# Altium schematic sheet hdmi_block.SchDoc
size A4; DrawnBy: ee; SheetTotal: HDMI Socket with ESD protection and level translator
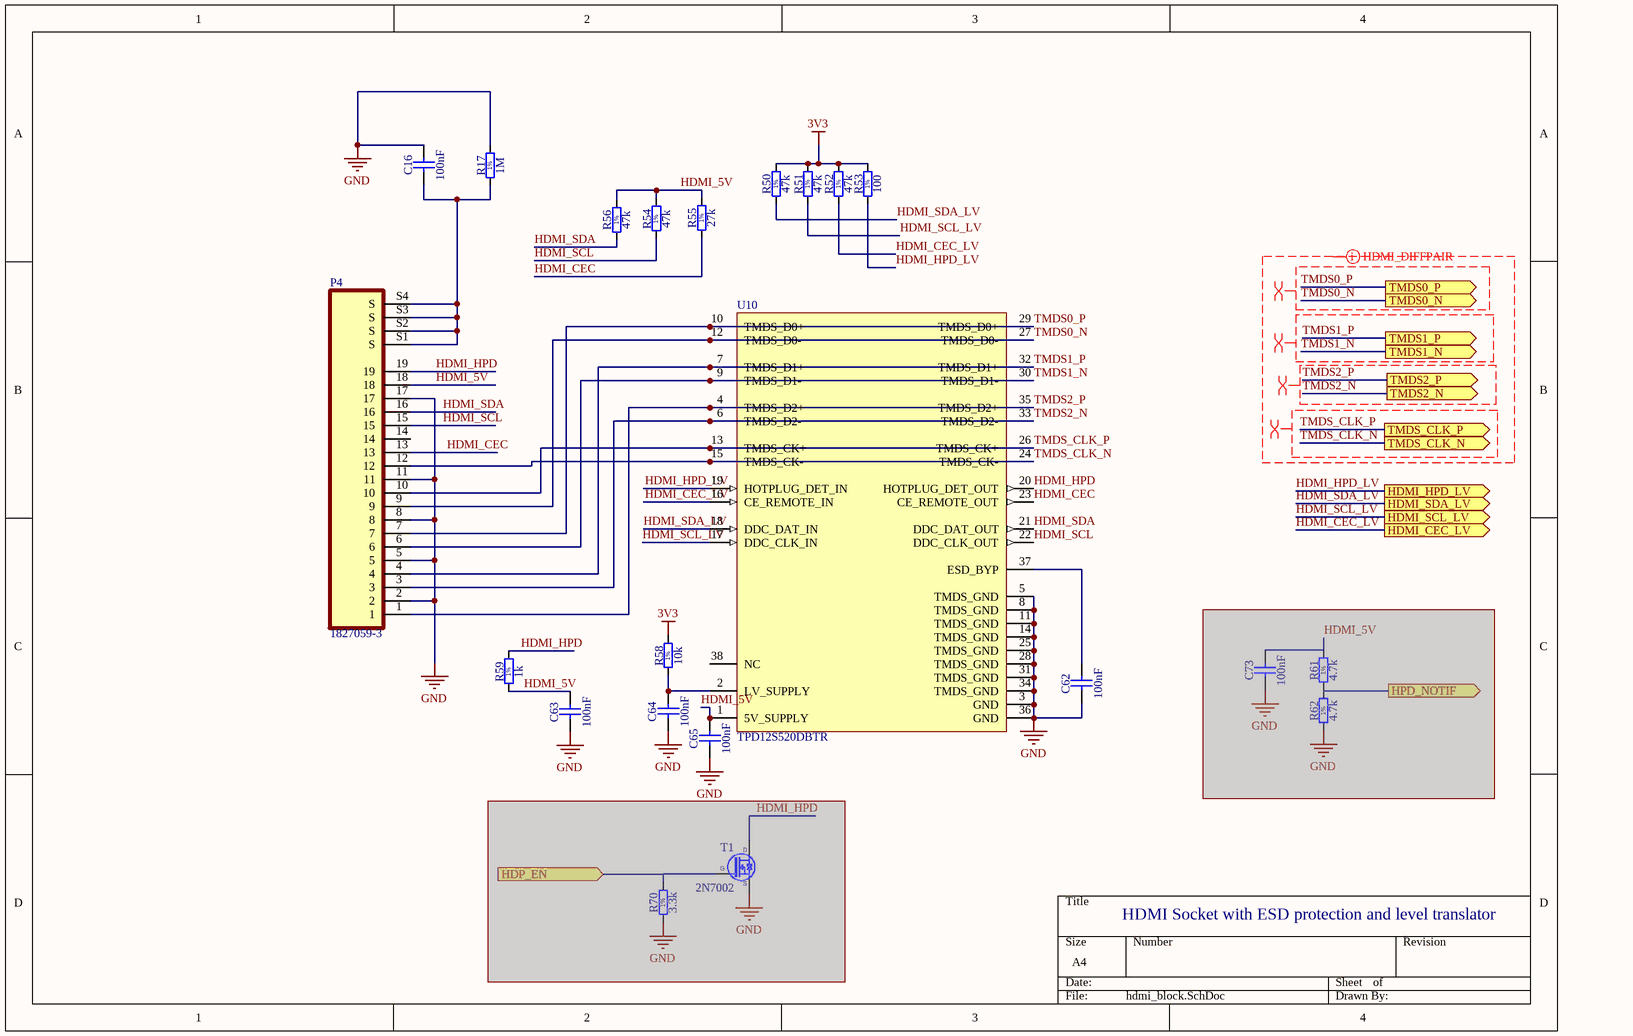
[diagram p0: hdmi_block.SchDoc]

## Parts
C16  100nF  [CAPC2013X100N]
C62  100nF  [CAPC2013X100N]
C63  100nF  [CAPC2013X100N]
C64  100nF  [CAPC2013X100N]
C65  100nF  [CAPC2013X100N]
C73  100nF  [CAPC2013X100N]  (masked out: inside a compile mask, not in the netlist)
P4  1827059-3  [TE_1827059-3]
R17  1M  [RESC1608X55N]
R50  47k  [RESC1608X55N]
R51  47k  [RESC1608X55N]
R52  47k  [RESC1608X55N]
R53  100  [RESC1608X55N]
R54  47k  [RESC1608X55N]
R55  27k  [RESC1608X55N]
R56  47k  [RESC1608X55N]
R58  10k  [RESC1608X55N]
R59  1k  [RESC1608X55N]
R61  4.7k  [RESC1608X55N]  (masked out: inside a compile mask, not in the netlist)
R62  4.7k  [RESC1608X55N]  (masked out: inside a compile mask, not in the netlist)
R70  3.3k  [RESC1608X55N]  (masked out: inside a compile mask, not in the netlist)
T1  2N7002  [SOT95P240X130-3N]  (masked out: inside a compile mask, not in the netlist)
U10  TPD12S520DBTR  [DBT38_L]

## Ports
HDMI_CEC_LV (out), HDMI_HPD_LV (out), HDMI_SCL_LV (out), HDMI_SDA_LV (out), HDP_EN (in), HPD_NOTIF (out), TMDS0_N (out), TMDS0_P (out), TMDS1_N (out), TMDS1_P (out), TMDS2_N (out), TMDS2_P (out), TMDS_CLK_N (out), TMDS_CLK_P (out)

## Nets
3V3: R50.2 R51.2 R52.2 R53.2 R58.2
GND: C16.2 C62.1 C63.1 C64.1 C65.1 P4.2 P4.5 P4.8 P4.11 P4.17 R17.2 U10.3(GND) U10.5(TMDS_GND) U10.8(TMDS_GND) U10.11(TMDS_GND) U10.14(TMDS_GND) U10.25(TMDS_GND) U10.28(TMDS_GND) U10.31(TMDS_GND) U10.34(TMDS_GND) U10.36(GND)
HDMI_5V: C63.2 C65.2 P4.18 R54.2 R55.2 R56.2 R59.1 U10.1(5V_SUPPLY)
HDMI_CEC: P4.13 R55.1 U10.23(CE_REMOTE_OUT)
HDMI_CEC_LV: R52.1 U10.16(CE_REMOTE_IN) ; port HDMI_CEC_LV
HDMI_HPD: P4.19 R59.2 U10.20(HOTPLUG_DET_OUT)
HDMI_HPD_LV: R53.1 U10.19(HOTPLUG_DET_IN) ; port HDMI_HPD_LV
HDMI_SCL: P4.15 R54.1 U10.22(DDC_CLK_OUT)
HDMI_SCL_LV: R51.1 U10.17(DDC_CLK_IN) ; port HDMI_SCL_LV
HDMI_SDA: P4.16 R56.1 U10.21(DDC_DAT_OUT)
HDMI_SDA_LV: R50.1 U10.18(DDC_DAT_IN) ; port HDMI_SDA_LV
TMDS0_N: P4.9 U10.12(TMDS_D0-) U10.27(TMDS_D0-) ; port TMDS0_N
TMDS0_P: P4.7 U10.10(TMDS_D0+) U10.29(TMDS_D0+) ; port TMDS0_P
TMDS1_N: P4.6 U10.9(TMDS_D1-) U10.30(TMDS_D1-) ; port TMDS1_N
TMDS1_P: P4.4 U10.7(TMDS_D1+) U10.32(TMDS_D1+) ; port TMDS1_P
TMDS2_N: P4.3 U10.6(TMDS_D2-) U10.33(TMDS_D2-) ; port TMDS2_N
TMDS2_P: P4.1 U10.4(TMDS_D2+) U10.35(TMDS_D2+) ; port TMDS2_P
TMDS_CLK_N: P4.12 U10.15(TMDS_CK-) U10.24(TMDS_CK-) ; port TMDS_CLK_N
TMDS_CLK_P: P4.10 U10.13(TMDS_CK+) U10.26(TMDS_CK+) ; port TMDS_CLK_P
NetC16_1: C16.1 P4.S1(S) P4.S2(S) P4.S3(S) P4.S4(S) R17.1
NetC62_2: C62.2 U10.37(ESD_BYP)
NetC64_2: C64.2 R58.1 U10.2(LV_SUPPLY)

Not connected (* = marked no-connect by the designer): P4 14; U10 38(NC)

## Layout directives
differential pair; net class HDMI_HS_LINES; rule Clearance Constraint [Clearance = 0.1mm]; rule Width Constraint [Pref Width = 0.1mm    Min Width = 0.1mm    Max Width = 0.2mm]; rule Differential Pairs Routing [Pref Gap = 0.1mm    Min Gap  = 0.1mm    Max Gap  = 0.25mmPref Width = 0.1mm    Min Width  = 0.1mm    Max Width  = 0.1mm]; rule Matched Net Lengths [Tolerance = 1mm]: TMDS0_N, TMDS0_P, TMDS1_N, TMDS1_P, TMDS2_N, TMDS2_P, TMDS_CLK_N, TMDS_CLK_P
rule Matched Net Lengths [Tolerance = 1mm]; net class TMDS0: TMDS0_N, TMDS0_P
rule Matched Net Lengths [Tolerance = 1mm]; net class TMDS1: TMDS1_N, TMDS1_P
rule Matched Net Lengths [Tolerance = 1mm]; net class TMDS2: TMDS2_N, TMDS2_P
rule Matched Net Lengths [Tolerance = 1mm]; net class TMDS3: TMDS_CLK_N, TMDS_CLK_P

## Notes on the sheet
- HDMI Socket with ESD protection and level translator
- (in symbol R0603_100K_1%_0.1W_100PPM) 1%

## Library data of the parts
C16 C62-C65 C73 = CC0805_1.5NF_50V_5%_C0G: Non-polarised capacitor; Part Description: SMD Multilayer Chip Ceramic Capacitor; Manufacturer: GENERIC; Manufacturer1 Part Number: C0805C152J5GACTU; Value: 1.5nF; Voltage: 50V; TC: C0G/NP0; Tolerance: ±5%; Part Number: CC0805_1.5NF_50V_5%_C0G; Component Kind: Standard; Component Type: Standard; Pin Count: 2; Status: Preferred; Manufacturer Part Number: CC0805_1.5NF_50V_5%_C0G; Case: 0805; Mounted: Yes; Socket: No; SMD: Yes; Sense: No; Manufacturer1 Example: KEMET; Manufacturer1 ComponentHeight: 1mm; HelpURL: \\cern.ch\dfs\Applications\Altium\Datasheets\CC0805_C0G_KEMET_(Commercial Grade).pdf; Author: CERN DEM BC; CreateDate: 18.11.2015; LatestRevisionDate: 18.11.2015
P4 = 1827059-3: EMBOSS PACKAGE HDMI CONN SMT NO-FLANGE T; MF: TE Connectivity; Availability: Unavailable; Value: *; TE_purchase_URL: https://www.te.com/usa-en/product-1827059-3.html?te_bu=Cor&te_type=disp&te_campaign=seda_glo_cor-seda-global-disp-prtnr-fy19-seda-model-bom-cta_sma-317_1&elqCampaignId=32493; Package: None; Price: None; SnapEDA_Link: https://www.snapeda.com/parts/1827059-3/TE%20Connectivity%20AMP%20Connectors/view-part/1316486/?ref=snap; MP: 1827059-3; EU_RoHS_Compliance: Compliant
R17 R50-R56 R58 R59 R61 R62 R70 = R0603_100K_1%_0.1W_100PPM: Resistor - 1%; Part Description: General Purpose Thick Film Chip Resistor; Manufacturer: GENERIC; Manufacturer1 Part Number: NRC06F1003TRF; Value: 100k; Power: 0.1W; TC: ±100ppm/°C; PressFit: No; Part Number: R0603_100K_1%_0.1W_100PPM; Component Kind: Standard; Component Type: Standard; Pin Count: 2; Status: Preferred; Tolerance: ±1%; Manufacturer Part Number: R0603_100K_1%_0.1W_100PPM; Case: 0603; Mounted: Yes; Sense: No; Socket: No; SMD: Yes; Manufacturer1 Example: NIC COMPONENT; Manufacturer1 ComponentHeight: 0.55mm; HelpURL: \\cern.ch\dfs\Applications\Altium\Datasheets\R0603_NIC_NRC.pdf; Author: CERN DEM JLC; CreateDate: 03.12.2007; LatestRevisionDate: 13.03.2008
T1 = 2N7002: N-CHANNEL MOSFET WITH DIODE; Part Description: 60V 280mA N-Channel Enhancement Mode Field Effect Transistor (FET); Manufacturer: FAIRCHILD SEMICONDUCTOR; PressFit: No; Bonding: No; Part Number: 2N7002; Component Kind: Standard; Component Type: Standard; Device: 2N7002; PackageDescription: SOT23 3-Leads, Pitch 0.95mm - Body 1.3x2.9mm, IPC Medium Density; Manufacturer Part Number: 2N7002; Pin Count: 3; Case: SOT23-3; Mounted: Yes; Socket: No; SMD: Yes; Sense: No; ComponentHeight: 1.3mm; HelpURL: \\cern.ch\dfs\Applications\Altium\Datasheets\2N7002.pdf; Author: CERN DEM JLC; CreateDate: 20.08.2008; LatestRevisionDate: 07.04.2009
U10 = TPD12S520DBTR: HDMI Receiver Port Protection and Interface Device, 12 Channels, -40 to +85 degC, 38-pin TSSOP (DBT), Green (RoHS & no Sb/Br); Manufacturer: Texas Instruments; Breakdown Voltage(Min)(V): 9; Differential Capacitance(pF): 0.05; IEC 61000-4-2 Contact(+/- kV): 8; IO Capacitance(Typ)(pF): 0.9; SubFamily: ESD Solution; DatasheetVersion: SLVS640C; PackageVersion: revI, Mar-2011; PackageReference: DBT38; PackageDescription: 38-Pin Plastic Small Outline 0.5 mm Pitch; Supplier 1: Digi-Key; Supplier Part Number 1: 296-23617-2-ND; Supplier 2: Digi-Key; Supplier Part Number 2: 296-23617-1-ND; Supplier 3: Digi-Key; Supplier Part Number 3: 296-23617-6-ND; Supplier 4: Newark; Supplier Part Number 4: 85M0176; Supplier 5: Mouser; Supplier Part Number 5: 595-TPD12S520DBTR; Eco-Plan: Green (RoHS & no Sb/Br); IO Leakage Current(nA): 0.05; Mounting Technology: Surface Mount; Code_JEDEC: MO-153; PartNumber: TPD12S520DBTR; ComponentLink1Description: Datasheet; ComponentLink1URL: http://www.ti.com/general/docs/lit/getliterature.tsp?genericPartNumber=TPD12S520&fileType=pdf; ComponentLink2Description: URL Link1; ComponentLink2URL: SamplesURL:http://www.ti.com/product/tpd12s520#samples